# Altium schematic sheet EEM_CONN.SchDoc: EEM connector
size 420 x 297 mm; Author: G.Kasprowicz; CompanyName: WUT ISE; DrawnBy: G.Kasprowicz; Organization: WUT ISE; Address1: PW ISE; Address2: Nowowiejska 15/19 00-665 Warsaw; Address3: gkasprow@gmail.com; DocumentNumber: 6; Revision: 2; SheetNumber: 6; SheetTotal: 10; ModifiedBy: -; CheckedDate: -; Title2: & LVDS circuit; DivGrp: WUT ISE; Designer: G.Kasprowicz; ModifiedDate: -; ProjectName: Sensor Box
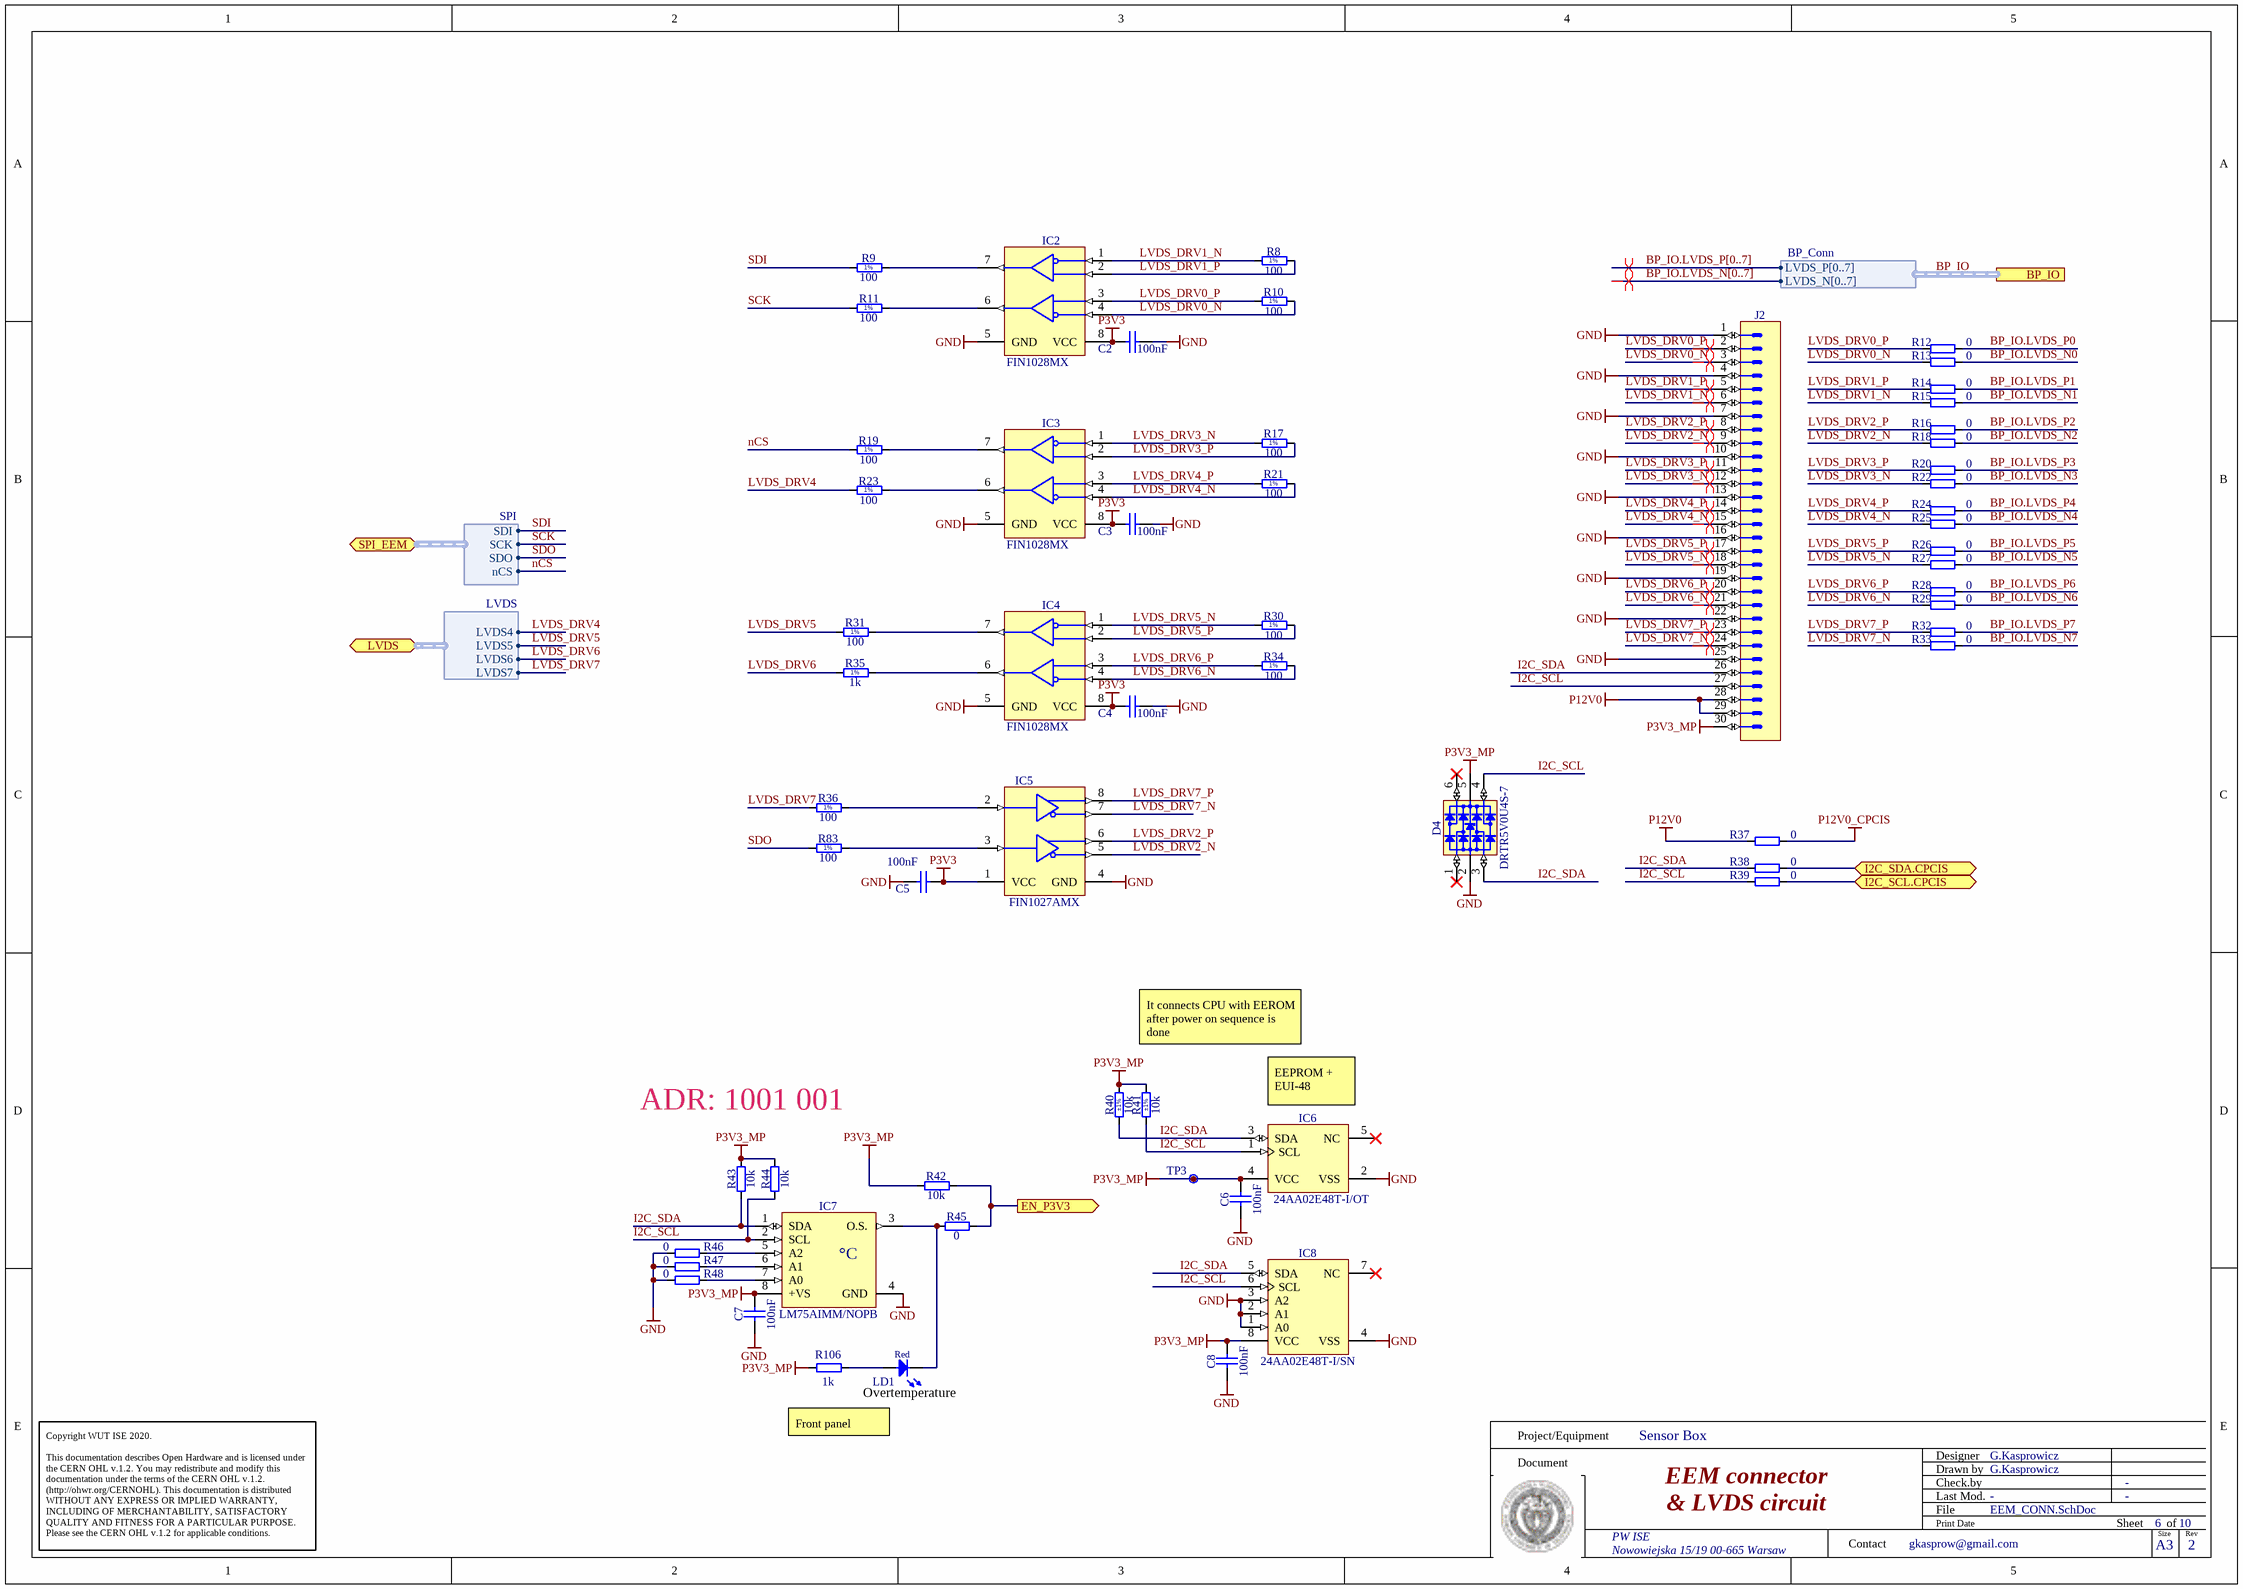
[diagram p0: EEM_CONN.SchDoc]

## Parts
C2  100nF  [CAPC1005X55N]
C3  100nF  [CAPC1005X55N]
C4  100nF  [CAPC1005X55N]
C5  100nF  [CAPC1005X55N]
C6  100nF  [CAPC1005X55N]
C7  100nF  [CAPC1005X55N]
C8  100nF  [CAPC1005X55N]
D4  DRTR5V0U4S-7  [SOT65P210X110-6N]
IC2  FIN1028MX  [SOIC127P600X175-8N]
IC3  FIN1028MX  [SOIC127P600X175-8N]
IC4  FIN1028MX  [SOIC127P600X175-8N]
IC5  FIN1027AMX  [SOIC127P600X175-8N]
IC6  24AA02E48T-I/OT  [SOT95P280X145-5N]
IC7  LM75AIMM/NOPB  [SOP65P490X109-8N]
IC8  24AA02E48T-I/SN  [SOIC127P600X175-8N]
J2  IDC  [3M_N2530-6002RB]  (value not drawn)
LD1  Red  [LED_DIALIGHT_555-200]
R8  100  [RESC1005X40N]
R9  100  [RESC1005X40N]
R10  100  [RESC1005X40N]
R11  100  [RESC1005X40N]
R12  0  [RESC1005X40N]
R13  0  [RESC1005X40N]
R14  0  [RESC1005X40N]
R15  0  [RESC1005X40N]
R16  0  [RESC1005X40N]
R17  100  [RESC1005X40N]
R18  0  [RESC1005X40N]
R19  100  [RESC1005X40N]
R20  0  [RESC1005X40N]
R21  100  [RESC1005X40N]
R22  0  [RESC1005X40N]
R23  100  [RESC1005X40N]
R24  0  [RESC1005X40N]
R25  0  [RESC1005X40N]
R26  0  [RESC1005X40N]
R27  0  [RESC1005X40N]
R28  0  [RESC1005X40N]
R29  0  [RESC1005X40N]
R30  100  [RESC1005X40N]
R31  100  [RESC1005X40N]
R32  0  [RESC1005X40N]
R33  0  [RESC1005X40N]
R34  100  [RESC1005X40N]
R35  1k  [RESC1005X40N]
R36  100  [RESC1005X40N]
R37  0  [RESC2012X60N]
R38  0  [RESC1005X40N]
R39  0  [RESC1005X40N]
R40  10k  Tolerance: ±1%  [RESC1005X40N]
R41  10k  Tolerance: ±1%  [RESC1005X40N]
R42  10k  [RESC1005X40N]
R43  10k  [RESC1005X40N]
R44  10k  [RESC1005X40N]
R45  0  [RESC1005X40N]
R46  0  [RESC1005X40N]
R47  0  [RESC1005X40N]
R48  0  [RESC1005X40N]
R83  100  [RESC1005X40N]
R106  1k  [RESC1005X40N]
TP3  Test Point  [TPS127]  (value not drawn)  (no BOM)

## Ports
BP_IO (harness BP_Conn), EN_P3V3 (out), I2C_SCL.CPCIS (bidir), I2C_SDA.CPCIS (bidir), LVDS (bidir, harness LVDS), SPI_EEM (bidir, harness SPI)

## Harnesses
BP_Conn: LVDS_P[0..7], LVDS_N[0..7]
SPI: SDI, SCK, SDO, nCS
LVDS: LVDS4, LVDS5, LVDS6, LVDS7

## Nets
GND: C2.1 C3.1 C4.1 C5.1 C6.1 C7.1 C8.1 D4.2(GND) IC2.5(GND) IC3.5(GND) IC4.5(GND) IC5.4(GND) IC6.2(VSS) IC7.4(GND) IC8.1(A0) IC8.2(A1) IC8.3(A2) IC8.4(VSS) J2.1 J2.4 J2.7 J2.10 J2.13 J2.16 J2.19 J2.22 J2.25 R46.1 R47.1 R48.1
P3V3: C2.2 C3.2 C4.2 C5.2 IC2.8(VCC) IC3.8(VCC) IC4.8(VCC) IC5.1(VCC)
P3V3_MP: C6.2 C7.2 C8.2 D4.5(VBUS) IC6.4(VCC) IC7.8(+VS) IC8.8(VCC) J2.30 R40.2 R41.2 R42.1 R43.2 R44.2 R106.2 TP3.1
P12V0: J2.28 J2.29 R37.1
P12V0_CPCIS: R37.2
BP_IO.LVDS_N0: R13.2
BP_IO.LVDS_N1: R15.2
BP_IO.LVDS_N2: R18.2
BP_IO.LVDS_N3: R22.2
BP_IO.LVDS_N4: R25.2
BP_IO.LVDS_N5: R27.2
BP_IO.LVDS_N6: R29.2
BP_IO.LVDS_N7: R33.2
BP_IO.LVDS_P0: R12.2
BP_IO.LVDS_P1: R14.2
BP_IO.LVDS_P2: R16.2
BP_IO.LVDS_P3: R20.2
BP_IO.LVDS_P4: R24.2
BP_IO.LVDS_P5: R26.2
BP_IO.LVDS_P6: R28.2
BP_IO.LVDS_P7: R32.2
EN_P3V3: R42.2 R45.2 ; port EN_P3V3
I2C_SCL: D4.4(I/O3) IC6.1(SCL) IC7.2(SCL) IC8.6(SCL) J2.27 R39.1 R41.1 R44.1
I2C_SCL.CPCIS: R39.2 ; port I2C_SCL.CPCIS
I2C_SDA: D4.3(I/O2) IC6.3(SDA) IC7.1(SDA) IC8.5(SDA) J2.26 R38.1 R40.1 R43.1
I2C_SDA.CPCIS: R38.2 ; port I2C_SDA.CPCIS
LVDS_DRV0_N: IC2.4(RIN2-) J2.3 R10.2 R13.1
LVDS_DRV0_P: IC2.3(RIN2+) J2.2 R10.1 R12.1
LVDS_DRV1_N: IC2.1(RIN1-) J2.6 R8.1 R15.1
LVDS_DRV1_P: IC2.2(RIN1+) J2.5 R8.2 R14.1
LVDS_DRV2_N: IC5.5(DOUT-) J2.9 R18.1
LVDS_DRV2_P: IC5.6(DOUT+) J2.8 R16.1
LVDS_DRV3_N: IC3.1(RIN1-) J2.12 R17.1 R22.1
LVDS_DRV3_P: IC3.2(RIN1+) J2.11 R17.2 R20.1
LVDS_DRV4: R23.1 ; port LVDS.LVDS4
LVDS_DRV4_N: IC3.4(RIN2-) J2.15 R21.2 R25.1
LVDS_DRV4_P: IC3.3(RIN2+) J2.14 R21.1 R24.1
LVDS_DRV5: R31.1 ; port LVDS.LVDS5
LVDS_DRV5_N: IC4.1(RIN1-) J2.18 R27.1 R30.1
LVDS_DRV5_P: IC4.2(RIN1+) J2.17 R26.1 R30.2
LVDS_DRV6: R35.1 ; port LVDS.LVDS6
LVDS_DRV6_N: IC4.4(RIN2-) J2.21 R29.1 R34.2
LVDS_DRV6_P: IC4.3(RIN2+) J2.20 R28.1 R34.1
LVDS_DRV7: R36.1 ; port LVDS.LVDS7
LVDS_DRV7_N: IC5.7(DOUT-) J2.24 R33.1
LVDS_DRV7_P: IC5.8(DOUT+) J2.23 R32.1
nCS: R19.1 ; port SPI_EEM.nCS
SCK: R11.1 ; port SPI_EEM.SCK
SDI: R9.1 ; port SPI_EEM.SDI
SDO: R83.1 ; port SPI_EEM.SDO
NetIC2_6: IC2.6(ROUT2) R11.2
NetIC2_7: IC2.7(ROUT1) R9.2
NetIC3_6: IC3.6(ROUT2) R23.2
NetIC3_7: IC3.7(ROUT1) R19.2
NetIC4_6: IC4.6(ROUT2) R35.2
NetIC4_7: IC4.7(ROUT1) R31.2
NetIC5_2: IC5.2(DIN1) R36.2
NetIC5_3: IC5.3(DIN2RIN-) R83.2
NetIC7_3: IC7.3(O.S.) LD1.1(C) R45.1
NetIC7_5: IC7.5(A2) R46.2
NetIC7_6: IC7.6(A1) R47.2
NetIC7_7: IC7.7(A0) R48.2
NetLD1_2: LD1.2(A) R106.1

Not connected (* = marked no-connect by the designer): D4 1(I/O1)* 6(I/O4)*; IC6 5(NC)*; IC8 7(NC)*

## Buses and harness runs
bus BP_IO.LVDS_N[0..7]
bus BP_IO.LVDS_P[0..7]
harness BP_IO = port BP_IO

## Layout directives
differential pair; differential pair class LVDS: (no net found under the mark), LVDS_DRV0_N, LVDS_DRV0_P, LVDS_DRV1_N, LVDS_DRV1_P, LVDS_DRV2_N, LVDS_DRV2_P, LVDS_DRV3_N, LVDS_DRV3_P, LVDS_DRV4_N, LVDS_DRV4_P, LVDS_DRV5_N, LVDS_DRV5_P, LVDS_DRV6_N, LVDS_DRV6_P, LVDS_DRV7_N, LVDS_DRV7_P

## Notes on the sheet
- It connects CPU with EEROM after power on sequence is done
- ADR: 1001 001
- (near IC6) EEPROM + EUI-48
- Overtemperature
- Front panel
- Project/Equipment
- Document
- Designer
- Drawn by
- Check.by
- Copyright WUT ISE 2020.
  This documentation describes Open Hardware and is licensed under the CERN OHL v.1.2. You may redistribute and modify this documentation under the terms of the CERN OHL v.1.2. (http://ohwr.org/CERNOHL). This documentation is distributed WITHOUT ANY EXPRESS OR IMPLIED WARRANTY, INCLUDING OF MERCHANTABILITY, SATISFACTORY QUALITY AND FITNESS FOR A PARTICULAR PURPOSE. Please see the CERN OHL v.1.2 for applicable conditions.
- Contact
- File
- Last Mod.
- Print Date
- Sheet
- Size
- A3
- of
- Rev
- (in symbol LM75AIMM/NOPB) °C
- (in symbol R0402_1K_1%_0.0625W_100PPM) 1%
- (in symbol R0402_100R_1%_0.0625W_100PPM) 1%

## Library data of the parts
C2-C8 = CC0402_100NF_16V_10%_X5R: Non-polarised capacitor; Part Description: SMD Multilayer Chip Ceramic Capacitor; Manufacturer: GENERIC; Manufacturer1 Part Number: GRM155R61C104KA88D; Voltage: 16V; TC: X5R; Tolerance: ±10%; Part Number: CC0402_100NF_16V_10%_X5R; Component Kind: Standard; Component Type: Standard; Pin Count: 2; Value: 100nF; Status: None; Manufacturer Part Number: CC0402_100NF_16V_10%_X5R; Case: 0402; Mounted: Yes; Socket: No; SMD: Yes; Sense: No; Manufacturer1 Example: MURATA; Manufacturer1 ComponentHeight: 0.55mm; HelpURL: \\cern.ch\dfs\Applications\Altium\Datasheets\CC0402_X5R_MURATA_GRM.pdf; Author: CERN DEM JLC
  C2-C6 C8: CreateDate: 10.12.2013; LatestRevisionDate: 10.12.2013
  C7: CreateDate: 10/12/2013; LatestRevisionDate: 10/12/2013
D4 = D_TVS_DRTR5V0U4S-7: Integrated Quad Ultra-Low Capacitance ESD Protection; Part Description: Integrated Quad Ultra-Low Capacitance ESD (±8kV) Protection; Manufacturer: DIODES; PressFit: No; Bonding: No; Status Comment: Active; Part Number: DRTR5V0U4S-7; Component Kind: Standard; Component Type: Standard; Device: DRTR5V0U4S-7; PackageDescription: SOT363, SC70-6, 0.65mm Pitch; 6 Pin, 1.25mm W X 2.00mm L X 1.10mm H body, IPC Medium Density; Status: Active; Manufacturer Part Number: DRTR5V0U4S-7; Pin Count: 6; Case: SOT363; Mounted: Yes; Socket: No; SMD: Yes; Sense: No; ComponentHeight: 1.1mm; HelpURL: \\cern.ch\dfs\Applications\Altium\Datasheets\PRTR5V0U4Y.pdf; Author: GK; CreateDate: 24.01.2017; LatestRevisionDate: 14.09.2020
IC2-IC4 = IFC_FIN1028: 3.3V LVDS 2-Bit High-Speed Differential Reciever; Manufacturer: ON Semiconductor; PressFit: No; Bonding: No; Part Number: FIN1028MX; Component Kind: Standard; Component Type: Standard; Device: FIN1028MX; PackageDescription: SOIC 8, Pitch 1.27mm - Body 4x5mm, IPC Medium Density; Part Description: 3.3V LVDS 2-Bit High-Speed Differential Reciever; Manufacturer Part Number: FIN1028MX; Pin Count: 8; Case: SOIC8; Mounted: Yes; Socket: No; SMD: Yes; Sense: No; ComponentHeight: 0.8mm; Author: GK; HelpURL: \\cern.ch\dfs\Applications\Altium\Datasheets\FIN1101K8X.pdf; CreateDate: 08/11/2016; LatestRevisionDate: 08/11/2016
IC5 = IFC_FIN1027A: 3.3V LVDS, 2-Bit, High-Speed, Differential Driver; Manufacturer: ON Semiconductor; PressFit: No; Bonding: No; Part Number: FIN1027AMX; Component Kind: Standard; Component Type: Standard; Device: FIN1027AMX; PackageDescription: SOIC 8, Pitch 1.27mm - Body 4x5mm, IPC Medium Density; Part Description: 3.3V LVDS, 2-Bit, High-Speed, Differential Driver; Manufacturer Part Number: FIN1027AMX; Pin Count: 8; Case: SOIC8; Mounted: Yes; Socket: No; SMD: Yes; Sense: No; ComponentHeight: 0.8mm; Author: GK; HelpURL: \\cern.ch\dfs\Applications\Altium\Datasheets\FIN1101K8X.pdf; CreateDate: 08/11/2016; LatestRevisionDate: 08/11/2016
IC6 = 24AA02E48T-I/OT: 1.7V-5.5V, 2K I2C Serial EEPROM With EUI-48 Node Identity; Manufacturer: MICROCHIP TECHNOLOGY; PressFit: No; Bonding: No; Part Number: 24AA02E48T-I/OT; Component Kind: Standard; Component Type: Standard; Device: 24AA02E48T-I/OT; PackageDescription: SOT, 0.95mm pitch; 5 pin, 1.60mm W X 2.90mm L X 1.45mm H body, IPC Medium Density; Part Description: 1.7V-5.5V, 2K I2C Serial EEPROM With EUI-48 Node Identity; Manufacturer Part Number: 24AA02E48T-I/OT; Pin Count: 5; Case: SOT23-5; Mounted: Yes; Socket: No; SMD: Yes; Sense: No; ComponentHeight: 1.45mm; HelpURL: \\cern.ch\dfs\Applications\Altium\Datasheets\24AA02E48T-I-OT.pdf; Author: CERN DEM MR; CreateDate: 31.03.2016; LatestRevisionDate: 31.03.2016
IC7 = LM75AIMM/NOPB: Digital Temperature Sensor and Thermal Watchdog with Two-Wire Interface; Part Description: -25° to +100°C ±2°C Digital Temperature Sensor and Thermal Watchdog with Two-Wire Interface; Manufacturer: TEXAS INSTRUMENTS; PressFit: No; Bonding: No; Part Number: LM75AIMM/NOPB; Component Kind: Standard; Component Type: Standard; Device: LM75AIMM/NOPB; PackageDescription: SOP, 0.65mm pitch; 8 pin,3.00mm W X 3.00mm L X 1.09mm H bodyI, PC Medium Density; Manufacturer Part Number: LM75AIMM/NOPB; Pin Count: 8; Case: SSOP8; Mounted: Yes; Socket: No; SMD: Yes; Sense: No; ComponentHeight: 1.09mm; HelpURL: \\cern.ch\dfs\Applications\Altium\Datasheets\LM75AIMM-NOPB.pdf; Author: CERN DEM JLC; CreateDate: 15.10.2012; LatestRevisionDate: 15.10.2012
IC8 = 24AA025E48-I/SN: 1.7V-5.5V, 2K I2C™ Serial EEPROMs with EUI-48™ Node Identity; Manufacturer: MICROCHIP TECHNOLOGY; PressFit: No; Bonding: No; Part Number: 24AA02E48T-I/SN; Component Kind: Standard; Component Type: Standard; Device: 24AA02E48T-I/SN; PackageDescription: SOIC 8, Pitch 1.27mm - Body 4x5mm, IPC Medium Density; Part Description: 1.7V-5.5V, 2K I2C™ Serial EEPROMs with EUI-48™ Node Identity; Manufacturer Part Number: 24AA02E48T-I/SN; Pin Count: 8; Case: SOIC8; Mounted: Yes; Socket: No; SMD: Yes; Sense: No; ComponentHeight: 1.75mm; HelpURL: \\cern.ch\dfs\Applications\Altium\Datasheets\24AA025E48-I-SN.pdf; Author: CERN DEM MR; CreateDate: 19.07.2016; LatestRevisionDate: 19.07.2016
J2 = 3M_N2530-6002RB: Connector 30 Male; Part Description: 30 Contacts - Straight .100'' x .100'' Low Profile Four-Wall Header, 2500 Series; Manufacturer: 3M; PressFit: No; Part Number: 3M_N2530-6002RB; Component Kind: Standard; Component Type: Standard; Pin Count: 30; Family: Header 30; Mounted: Yes; Socket: No; SMD: No; Sense: No; Status: None; Manufacturer Part Number: N2530-6002RB; ComponentHeight: 10.03mm; HelpURL: \\cern.ch\dfs\Applications\Altium\Datasheets\3M_N2530-6002RB.pdf; Author: CERN DEM JLC; CreateDate: 11.02.2009; LatestRevisionDate: 11.08.2009
LD1 = LED_DIALIGHT_555-2001F: LED Red 1C 2A; Part Description: Single 2mm Red LED CBI® Circuit Board Indicator; PressFit: No; Bonding: No; Part Number: LED_DIALIGHT_555-2001F; Component Kind: Standard; Component Type: Standard; Color: Red; PackageDescription: Single 2mm Red LED, Body 5.08x2.54mm, Pin spacing 2.54mm; Manufacturer: DIALIGHT; Manufacturer Part Number: 555-2001F; Pin Count: 2; Mounted: Yes; Socket: No; SMD: No; Sense: No; ComponentHeight: 6.35mm; HelpURL: \\cern.ch\dfs\Applications\Altium\Datasheets\LED_DIALIGHT_555-2001F.pdf; Author: CERN DEM JMW; CreateDate: 22.09.2008; LatestRevisionDate: 17.03.2010
R8-R11 R17 R19 R21 R23 R30 R31 R34 R36 R83 = R0402_100R_1%_0.0625W_100PPM: Resistor - 1%; Part Description: General Purpose Thick Film Chip Resistor; Manufacturer: GENERIC; Manufacturer1 Part Number: 232270671001L; TC: ±100ppm/°C; PressFit: No; Part Number: R0402_100R_1%_0.0625W_100PPM; Component Kind: Standard; Component Type: Standard; Pin Count: 2; Value: 100; Status: Not Recommended; Power: 0.0625W; Tolerance: ±1%; Manufacturer Part Number: R0402_100R_1%_0.0625W_100PPM; Case: 0402; Mounted: Yes; Sense: No; Socket: No; SMD: Yes; Manufacturer1 Example: YAGEO PHYCOMP; Manufacturer1 ComponentHeight: 0.4mm; HelpURL: \\cern.ch\dfs\Applications\Altium\Datasheets\R0402_Phycomp_RC0402.pdf; Author: CERN DEM JLC; CreateDate: 03.12.2007; LatestRevisionDate: 17.10.2012
R12-R16 R18 R20 R22 R24-R29 R32 R33 R38 R39 R45-R48 = R0402_0R_JUMPER: Resistor; Part Description: 1A (0.05R Max DC Resistance) Zero Ohm Jumper; Manufacturer: GENERIC; Manufacturer1 Part Number: 232270591001L; PressFit: No; Part Number: R0402_0R_JUMPER; Component Kind: Standard; Component Type: Standard; Pin Count: 2; Value: 0; Status: Not Recommended; Manufacturer Part Number: R0402_0R_JUMPER; Case: 0402; Mounted: Yes; Sense: No; Socket: No; SMD: Yes; Manufacturer1 Example: YAGEO PHYCOMP; Manufacturer1 ComponentHeight: 0.4mm; HelpURL: \\cern.ch\dfs\Applications\Altium\Datasheets\R0402_Phycomp_RC0402.pdf; Author: CERN DEM JLC
  R12-R16 R18 R20 R22 R24-R29 R32 R33 R38 R39: CreateDate: 03.12.2007; LatestRevisionDate: 17.10.2012
  R45-R48: CreateDate: 03/12/2007; LatestRevisionDate: 17/10/2012
R35 = R0402_1K_1%_0.0625W_100PPM: Resistor - 1%; Part Description: General Purpose Thick Film Chip Resistor; Manufacturer: GENERIC; Manufacturer1 Part Number: 232270671002L; TC: ±100ppm/°C; Part Number: R0402_1K_1%_0.0625W_100PPM; Component Kind: Standard; Component Type: Standard; Pin Count: 2; Value: 1k; Status: Not recommended; Power: 0.0625W; Tolerance: ±1%; Manufacturer Part Number: R0402_1K_1%_0.0625W_100PPM; Case: 0402; Mounted: Yes; Sense: No; Socket: No; SMD: Yes; Manufacturer1 Example: YAGEO PHYCOMP; Manufacturer1 ComponentHeight: 0.4mm; HelpURL: \\cern.ch\dfs\Applications\Altium\Datasheets\R0402_Phycomp_RC0402.pdf; Author: CERN DEM JLC; CreateDate: 2007-12-03; LatestRevisionDate: 2012-10-17
R37 = R0805_0R_JUMPER: Resistor; Part Description: 2A (0.05R Max DC Resistance) Zero Ohm Jumper; Manufacturer: GENERIC; Manufacturer1 Part Number: NRC10Z0; PressFit: No; Part Number: R0805_0R_JUMPER; Component Kind: Standard; Component Type: Standard; Pin Count: 2; Value: 0; Status: Preferred; Manufacturer Part Number: R0805_0R_JUMPER; Case: 0805; Mounted: Yes; Sense: No; Socket: No; SMD: Yes; Manufacturer1 Example: NIC COMPONENT; Manufacturer1 ComponentHeight: 0.6mm; HelpURL: \\cern.ch\dfs\Applications\Altium\Datasheets\R0805_NIC_NRC.pdf; Author: CERN DEM JLC; CreateDate: 03.12.2007; LatestRevisionDate: 13.03.2008
R40-R44 = R0402_10K_1%_0.0625W_100PPM: Resistor - 1%; Part Description: General Purpose Thick Film Chip Resistor; Manufacturer: GENERIC; Manufacturer1 Part Number: 232270671003L; TC: ±100ppm/°C; PressFit: No; Part Number: R0402_10K_1%_0.0625W_100PPM; Component Kind: Standard; Component Type: Standard; Pin Count: 2; Value: 10k; Status: Not Recommended; Power: 0.0625W; Manufacturer Part Number: R0402_10K_1%_0.0625W_100PPM; Case: 0402; Mounted: Yes; Sense: No; Socket: No; SMD: Yes; Manufacturer1 Example: YAGEO PHYCOMP; Manufacturer1 ComponentHeight: 0.4mm; HelpURL: \\cern.ch\dfs\Applications\Altium\Datasheets\R0402_Phycomp_RC0402.pdf; Author: CERN DEM JLC
  R40 R41: CreateDate: 03.12.2007; LatestRevisionDate: 17.10.2012
  R42-R44: Tolerance: ±1%; CreateDate: 03/12/2007; LatestRevisionDate: 17/10/2012
R106 = R0402_1K_1%_0.0625W_100PPM: Resistor - 1%; Part Description: General Purpose Thick Film Chip Resistor; Manufacturer: GENERIC; Manufacturer1 Part Number: 232270671002L; TC: ±100ppm/°C; PressFit: No; Part Number: R0402_1K_1%_0.0625W_100PPM; Component Kind: Standard; Component Type: Standard; Pin Count: 2; Value: 1k; Status: Not Recommended; Power: 0.0625W; Tolerance: ±1%; Manufacturer Part Number: R0402_1K_1%_0.0625W_100PPM; Case: 0402; Mounted: Yes; Sense: No; Socket: No; SMD: Yes; Manufacturer1 Example: YAGEO PHYCOMP; Manufacturer1 ComponentHeight: 0.4mm; HelpURL: \\cern.ch\dfs\Applications\Altium\Datasheets\R0402_Phycomp_RC0402.pdf; Author: CERN DEM JLC; CreateDate: 03/12/2007; LatestRevisionDate: 17/10/2012
TP3 = SMD_PAD_1.27X1.27MM: Part Description: 1.27mm x 1.27mm PCB Copper Area (SMD Test Point); Mounted: No; Part Number: SMD_PAD_1.27X1.27MM; Component Type: Standard (No BOM); Pin Count: 1; Family: Test Point; Socket: No; SMD: Yes; Sense: No; Status: None; ComponentHeight: 0mm; HelpURL: Undefined; Author: CERN DEM JLC; CreateDate: 12.01.2008; LatestRevisionDate: 12.01.2008; PackageDescription: 1.27mm x 1.27mm PCB Copper Area (SMD Test Point)